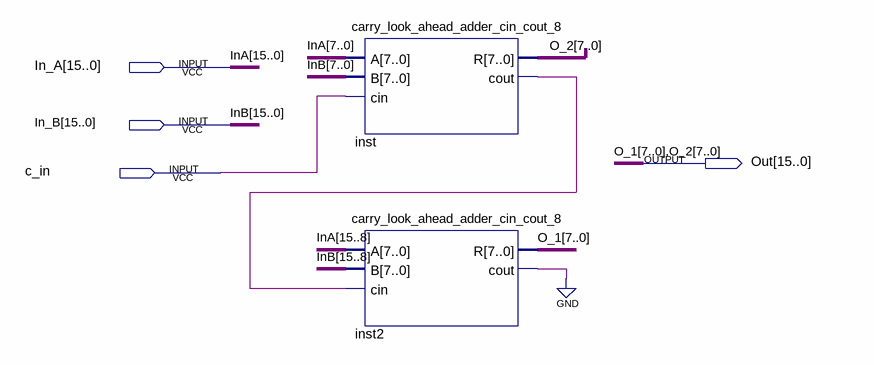
[diagram p0: schematic sheet]
// Quartus schematic two_CLA_8_adders.bdf as structural Verilog: 2 symbols, 4 pins
module two_CLA_8_adders (
  input  [15:0] In_A,
  input  [15:0] In_B,
  input  c_in,
  output [15:0] Out
);

  wire inst2_cout, inst_cout;

  carry_look_ahead_adder_cin_cout_8 inst (.A(In_A[7:0]), .B(In_B[7:0]), .cin(c_in), .R(Out[7:0]), .cout(inst_cout));
  carry_look_ahead_adder_cin_cout_8 inst2 (
    .A(In_A[15:8]), .B(In_B[15:8]), .cin(inst_cout), .R(Out[15:8]), .cout(inst2_cout));
  // also tied to GND on the sheet: inst2_cout

  // Other names for the same wires on the sheet: InA[15:0] = In_A; InB[15:0] = In_B; O_1[7:0] = Out[15:8];
  //   O_2[7:0] = Out[7:0]
endmodule
